# Altium schematic sheet Sheet1.SchDoc
size A3; SheetNumber: 1; SheetTotal: 1
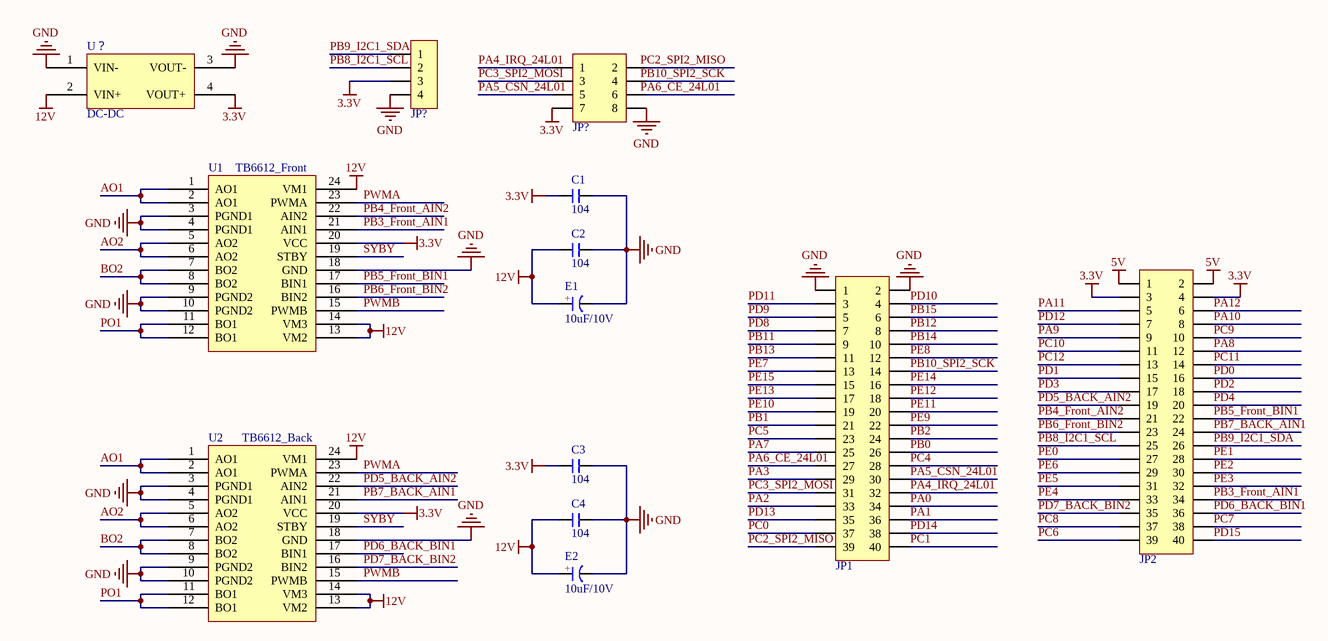
[diagram p0: Sheet1.SchDoc]

## Parts
(Parts that share a designator on the sheet are numbered #1, #2 ... from top to bottom, then left to right.)
C1  104  [C0201_L]
C2  104  [C0201_L]
C3  104  [C0603_L]
C4  104  [C0603_L]
E1  10uF/10V  [C_3528]
E2  10uF/10V  [C_3528]
JP1  Header 2X11  [IDC2.54-LI-2x20P]  (value not drawn)
JP2  Header 2X11  [IDC2.54-LI-2x20P]  (value not drawn)
JP?#1  HDR-1X4  [XH2.54-WI-4P]  (value not drawn)
JP?#2  Header 4X2  [IDC2.54-LI-2x4P]  (value not drawn)
U1  TB6612_Front  [SSOP24]
U2  TB6612_Back  [SSOP24]
U？  DC-DC  [DC-DC]

## Nets
3.3V: C1.1 C3.1 JP2.3 JP2.4 JP?#1.3 JP?#2.7 U1.20(VCC) U2.20(VCC) U？.4(VOUT+)
5V: JP2.1 JP2.2
12V: C2.1 C4.1 E1.1(A) E2.1(A) U1.13(VM2) U1.14(VM3) U1.24(VM1) U2.13(VM2) U2.14(VM3) U2.24(VM1) U？.2(VIN+)
GND: C1.2 C2.2 C3.2 C4.2 E1.2(K) E2.2(K) JP1.1 JP1.2 JP?#1.4 JP?#2.8 U1.3(PGND1) U1.4(PGND1) U1.9(PGND2) U1.10(PGND2) U1.18(GND) U2.3(PGND1) U2.4(PGND1) U2.9(PGND2) U2.10(PGND2) U2.18(GND) U？.1(VIN-) U？.3(VOUT-)
AO1: U1.1(AO1) U1.2(AO1) U2.1(AO1) U2.2(AO1)
AO2: U1.5(AO2) U1.6(AO2) U2.5(AO2) U2.6(AO2)
BO2: U1.7(BO2) U1.8(BO2) U2.7(BO2) U2.8(BO2)
PA0: JP1.34
PA1: JP1.36
PA2: JP1.33
PA3: JP1.29
PA4_IRQ_24L01: JP1.32 JP?#2.1
PA5_CSN_24L01: JP1.30 JP?#2.5
PA6_CE_24L01: JP1.27
PA7: JP1.25
PA8: JP2.12
PA9: JP2.9
PA10: JP2.8
PA11: JP2.5
PA12: JP2.6
PB0: JP1.26
PB1: JP1.21
PB2: JP1.24
PB3_Front_AIN1: JP2.34 U1.21(AIN1)
PB4_Front_AIN2: JP2.21 U1.22(AIN2)
PB5_Front_BIN1: JP2.22 U1.17(BIN1)
PB6_Front_BIN2: JP2.23 U1.16(BIN2)
PB7_BACK_AIN1: JP2.24 U2.21(AIN1)
PB8_I2C1_SCL: JP2.25 JP?#1.2
PB9_I2C1_SDA: JP2.26 JP?#1.1
PB10_SPI2_SCK: JP1.14
PB11: JP1.9
PB12: JP1.8
PB13: JP1.11
PB14: JP1.10
PB15: JP1.6
PC0: JP1.37
PC1: JP1.40
PC2_SPI2_MISO: JP1.39
PC3_SPI2_MOSI: JP1.31 JP?#2.3
PC4: JP1.28
PC5: JP1.23
PC6: JP2.39
PC7: JP2.38
PC8: JP2.37
PC9: JP2.10
PC10: JP2.11
PC11: JP2.14
PC12: JP2.13
PD0: JP2.16
PD1: JP2.15
PD2: JP2.18
PD3: JP2.17
PD4: JP2.20
PD5_BACK_AIN2: JP2.19 U2.22(AIN2)
PD6_BACK_BIN1: JP2.36 U2.17(BIN1)
PD7_BACK_BIN2: JP2.35 U2.16(BIN2)
PD8: JP1.7
PD9: JP1.5
PD10: JP1.4
PD11: JP1.3
PD12: JP2.7
PD13: JP1.35
PD14: JP1.38
PD15: JP2.40
PE0: JP2.27
PE1: JP2.28
PE2: JP2.30
PE3: JP2.32
PE4: JP2.33
PE5: JP2.31
PE6: JP2.29
PE7: JP1.13
PE8: JP1.12
PE9: JP1.22
PE10: JP1.19
PE11: JP1.20
PE12: JP1.18
PE13: JP1.17
PE14: JP1.16
PE15: JP1.15
PO1: U1.11(BO1) U1.12(BO1) U2.11(BO1) U2.12(BO1)
PWMA: U1.23(PWMA) U2.23(PWMA)
PWMB: U1.15(PWMB) U2.15(PWMB)
SYBY: U1.19(STBY) U2.19(STBY)

Not connected (* = marked no-connect by the designer): JP?#2 2 4 6

## Notes on the sheet
- Labels drawn without touching a wire or pin: PA6_CE_24L01, PB10_SPI2_SCK, PC2_SPI2_MISO
- (in symbol CE_SMD) +

## Library data of the parts
C1-C4 = C: 贴片电容; BOM名称: 无极性贴片电容; 淘宝ID: 封装库来自淘宝 ID：黄晶宝石; 联系售后，技术支持: https://shop463601444.taobao.com; 唯一出售店铺网址: https://shop463601444.taobao.com
E1 E2 = CE_SMD: 贴片电解电容; 版权归属: 封装库来自淘宝 ID：黄晶宝石; BOM名称: 贴片电解电容; 联系售后: https://item.taobao.com/item.htm?id=566775463719
JP1 JP2 = Header 20X2: 20*2P接插件; 学习资源: 最新版本发布https://item.taobao.com/item.htm?id=566775463719; 版权归属: 封装库来自淘宝 ID：黄晶宝石; BOM名称: 20*2P接插件
JP?#1 = Header 4: OLED屏幕; BOM名称: 4P接插件; 版权归属: 封装库来自淘宝 ID：黄晶宝石; 学习资源: 最新版本发布https://item.taobao.com/item.htm?id=566775463719
JP?#2 = Header 4X2: 4*2P接插件; 版权归属: 封装库来自淘宝 ID：黄晶宝石; BOM名称: 4*2P接插件
U1 U2 = Component_1: TB6612